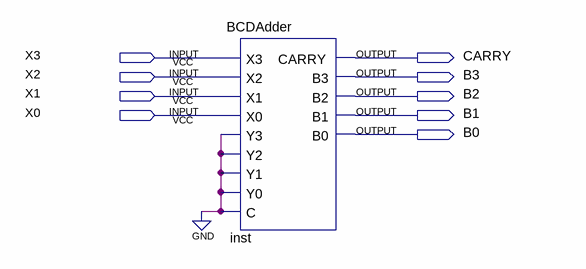
[diagram p0: schematic sheet]
// Quartus schematic BCDScaler.bdf as structural Verilog: 1 symbols, 9 pins
module BCDScaler (
  input  X3,
  input  X2,
  input  X1,
  input  X0,
  output CARRY,
  output B3,
  output B2,
  output B1,
  output B0
);

  BCDAdder inst (
    .X3(X3), .X2(X2), .X1(X1), .X0(X0), .Y3(1'b0), .Y2(1'b0), .Y1(1'b0), .Y0(1'b0), .C(1'b0), .CARRY(CARRY),
    .B3(B3), .B2(B2), .B1(B1), .B0(B0));
endmodule
